# EAGLE schematic airbrake-minimal (EAGLE 8.4.2)
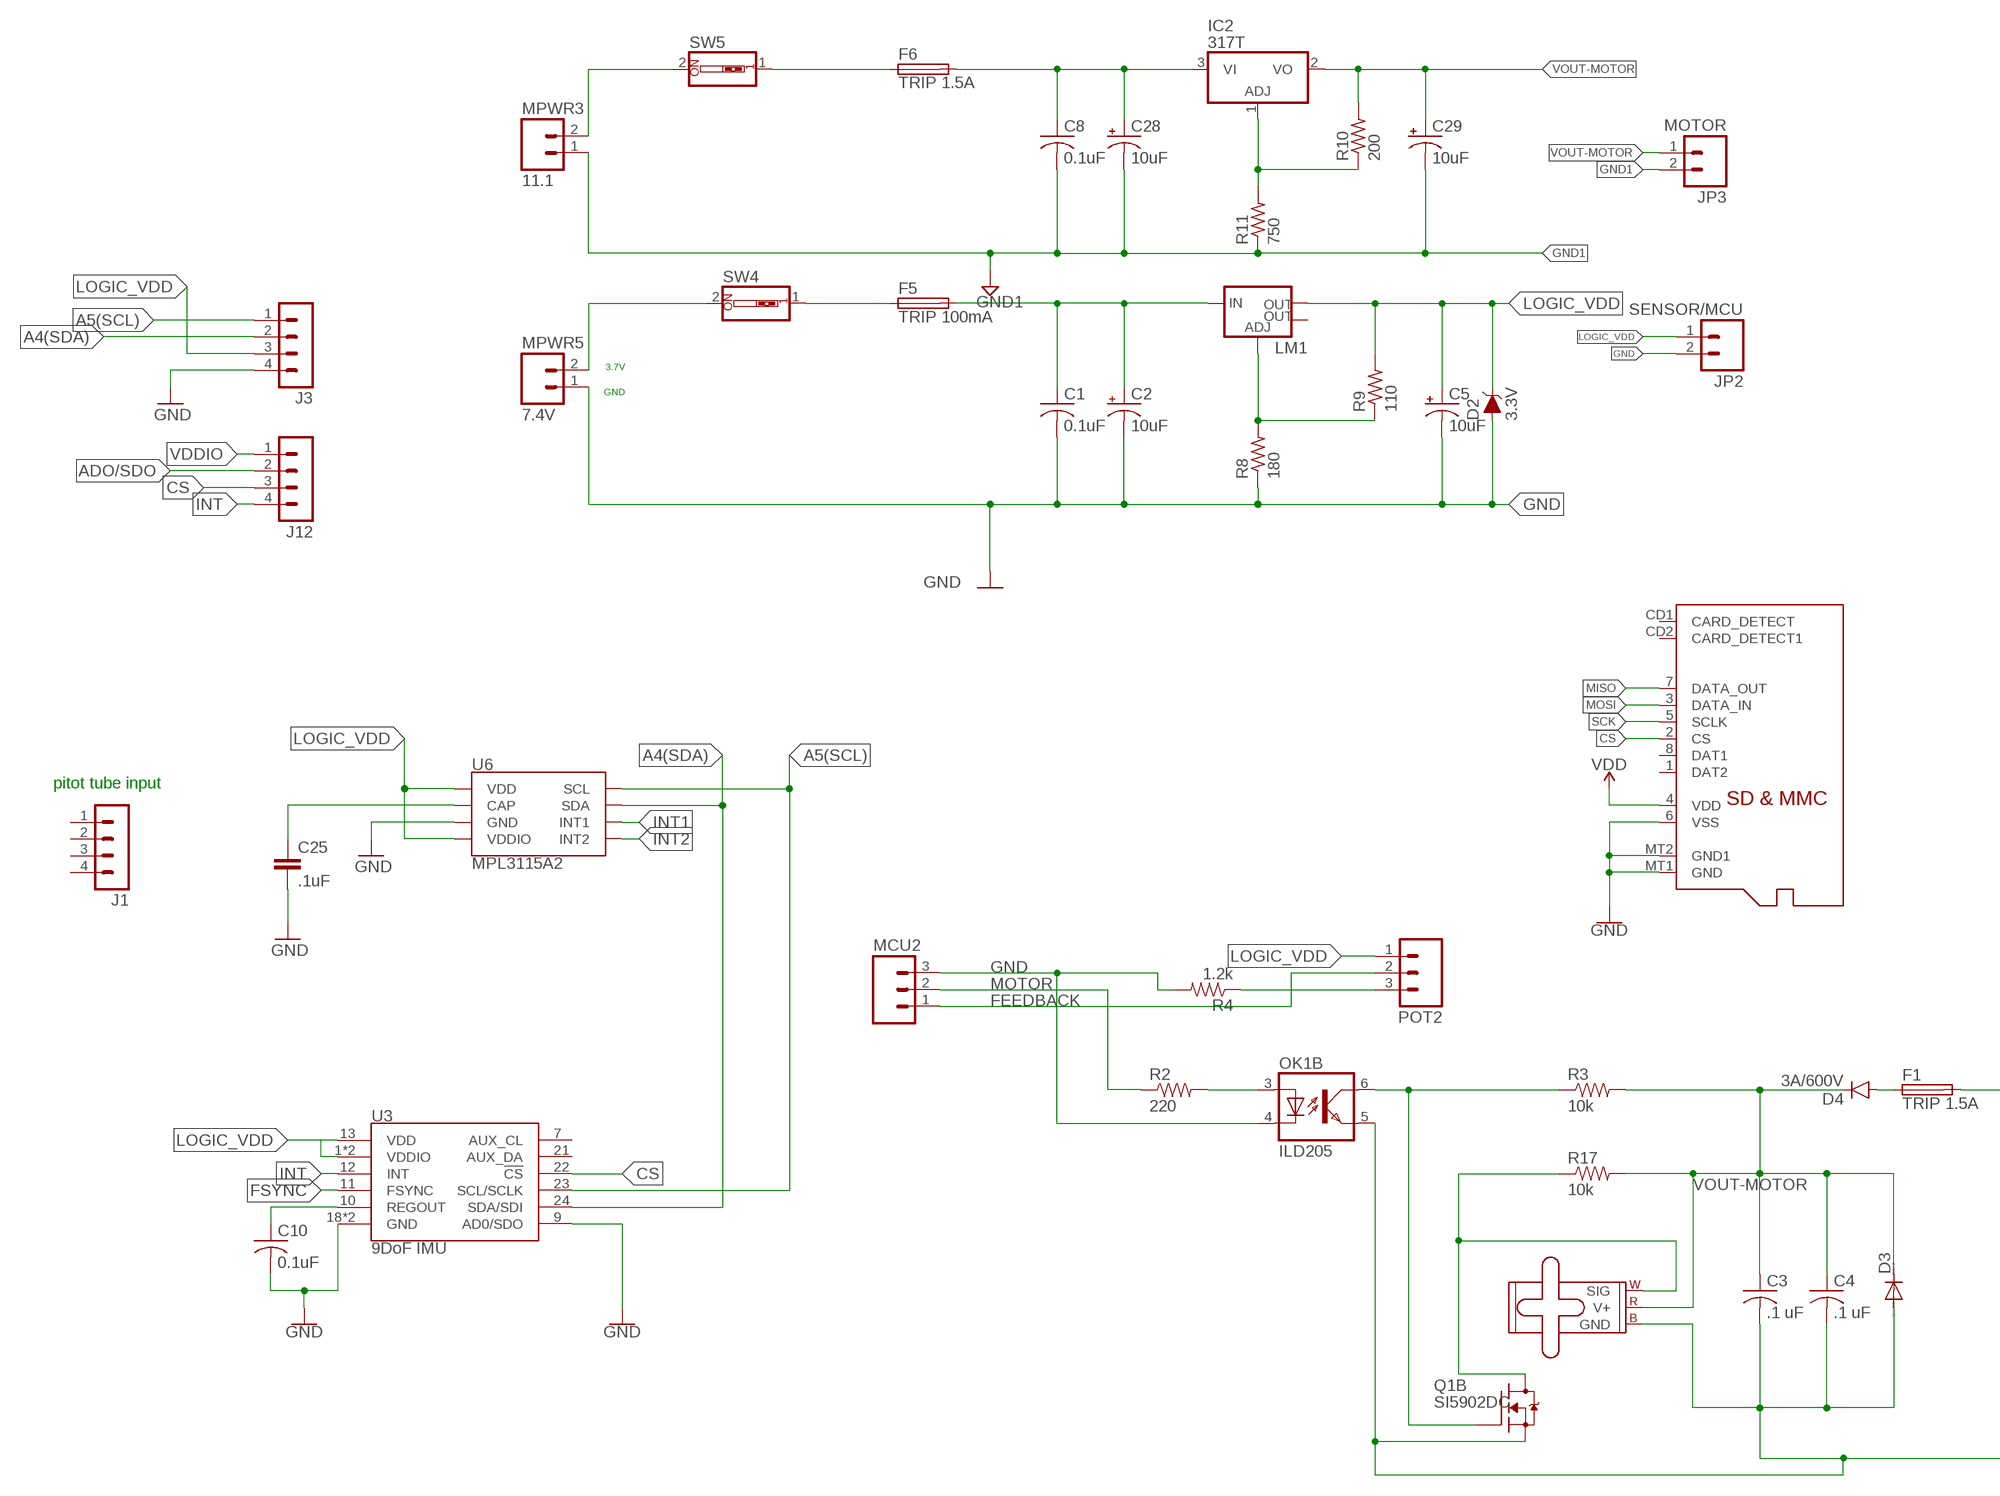
[diagram p0: schematic, sheet 1, part 1 of 2]
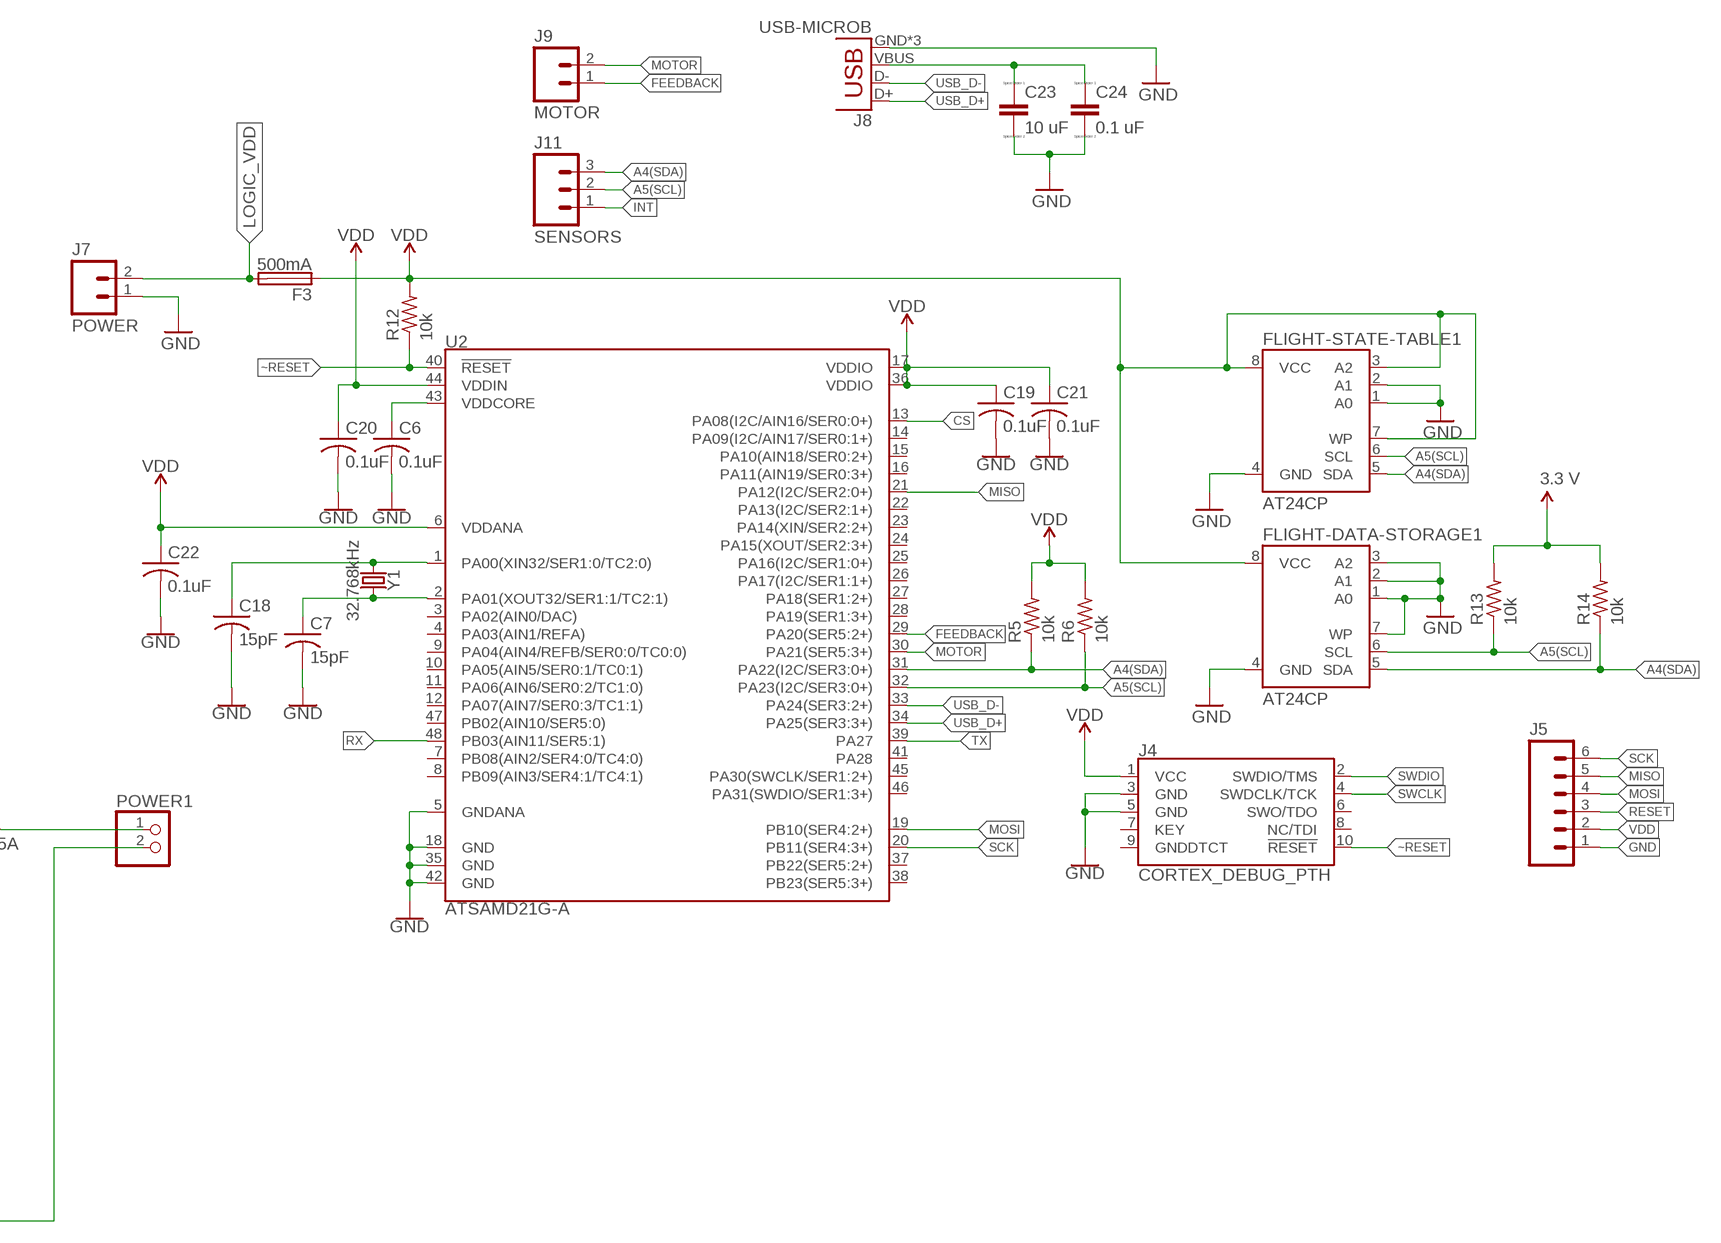
[diagram p1: schematic, sheet 1, part 2 of 2]

## Parts
C1  0.1uF  C-USC1206  [C1206]
C2  10uF  10UF-POLAR-EIA3216-16V-10%(TANT)  [EIA3216]
C3  .1 uF  C-USC1206K  [C1206K]
C4  .1 uF  C-USC1206K  [C1206K]
C5  10uF  10UF-POLAR-EIA3216-16V-10%(TANT)  [EIA3216]
C6  0.1uF  C-USC0805  [C0805]
C7  15pF  C-USC0805  [C0805]
C8  0.1uF  C-USC1206  [C1206]
C10  0.1uF  C-USC0805  [C0805]
C18  15pF  C-USC0805  [C0805]
C19  0.1uF  C-USC0805  [C0805]
C20  0.1uF  C-USC0805  [C0805]
C21  0.1uF  C-USC0805  [C0805]
C22  0.1uF  C-USC0805  [C0805]
C23  10 uF  CC1206  [C1206]
C24  0.1 uF  CC1206  [C1206]
C25  .1uF  10UF-1206-6.3V-20%  [1206]
C28  10uF  10UF-POLAR-EIA3216-16V-10%(TANT)  [EIA3216]
C29  10uF  10UF-POLAR-EIA3216-16V-10%(TANT)  [EIA3216]
D2  3.3V  DIODE-ZENER-BZT52C3V6S  [SOD-323@2]
D3  DIODE-DO-214AC  [DO-214AC]
D4  3A/600V  DIODESMA-ALT  [SMA-DIODE_ALT]
F1  TRIP 1.5A  PICOFUSE  [PICOFUSE]
F3  500mA  PICOFUSE  [PICOFUSE]
F5  TRIP 100mA  PICOFUSE  [PICOFUSE]
F6  TRIP 1.5A  PICOFUSE  [PICOFUSE]
FLIGHT-DATA-STORAGE1  AT24CP  [DIL08]
FLIGHT-STATE-TABLE1  AT24CP  [DIL08]
IC2  317T  [TO220H]
J1  MA04-1  [MA04-1]
J3  MA04-1  [MA04-1]
J4  CORTEX_DEBUG_PTH  [2X5-PTH-1.27MM]
J5  M06LOCK  [1X06_LOCK]
J7  POWER  M02LOCK  [1X02_LOCK]
J8  USB-MICROB  [USB-MICROB]
J9  MOTOR  M02LOCK  [1X02_LOCK]
J11  SENSORS  M03LOCK  [1X03_LOCK]
J12  MA04-1  [MA04-1]
JP2  SENSOR/MCU  M02PTH  [1X02]
JP3  MOTOR  M02PTH  [1X02]
LM1  V_REG_LM1117SOT223  [SOT223]
M2  SMALL_SERVO  [1X03]
MCU2  M03PTH  [1X03]
MPWR3  11.1  M02PTH  [1X02]
MPWR5  7.4V  M02PTH  [1X02]
OK1  ILD205  [SOIC08]
POT2  M03PTH  [1X03]
POWER1  PINHD-1X2  [1X02]
Q1  SI5902DC  [1206-8CHIP-FET]
R2  220  RESISTOR1206  [1206]
R3  10k  RESISTOR1206  [1206]
R4  1.2k  RESISTOR1206  [1206]
R5  10k  R-US_R0805  [R0805]
R6  10k  R-US_R0805  [R0805]
R8  180  R-US_M1206  [M1206]
R9  110  R-US_M1206  [M1206]
R10  200  R-US_M1206  [M1206]
R11  750  R-US_M1206  [M1206]
R12  10k  R-US_R0805  [R0805]
R13  10k  R-US_R1206  [R1206]
R14  10k  R-US_R1206  [R1206]
R17  10k  RESISTOR1206  [1206]
SW4  SW_DIP-1  [EDG-01]
SW5  SW_DIP-1  [EDG-01]
U2  ATSAMD21G-A  [TQFP-48]
U3  9DoF IMU  MPU-9250  [QFN24-3X3]
U6  MPL3115A2  [LGA-8]
U$2  MICROSD  [MICROSD]
Y1  32.768kHz  CRYSTAL-32.768KHZSMD-MC146  [CRYSTAL-SMD-MC-146]

## Nets
A4(SDA): FLIGHT-DATA-STORAGE1.5(SDA) FLIGHT-STATE-TABLE1.5(SDA) J3.2 J11.3 R5.1 R14.1 U2.31(PA22(I2C/SER3:0+)) U3.24(SDA/SDI) U6.7(SDA)
A5(SCL): FLIGHT-DATA-STORAGE1.6(SCL) FLIGHT-STATE-TABLE1.6(SCL) J3.1 J11.2 R6.1 R13.1 U2.32(PA23(I2C/SER3:0+)) U3.23(SCL/SCLK) U6.8(SCL)
ADO/SDO: J12.2
CS: J12.3 U2.13(PA08(I2C/AIN16/SER0:0+)) U3.22(!CS) U$2.2(CS)
DRAIN1 [motor]: M2.1(SIG) Q1.5(B:D) Q1.6(B:D) R17.1
FEEDBACK: J9.1 MCU2.1 POT2.2 U2.29(PA20(SER5:2+))
FSYNC: U3.11(FSYNC)
GND: C1.2 C2.- C5.- C6.2 C7.2 C10.2 C18.2 C19.2 C20.2 C21.2 C22.2 C23.2 C24.2 C25.2 D2.A FLIGHT-DATA-STORAGE1.1(A0) FLIGHT-DATA-STORAGE1.2(A1) FLIGHT-DATA-STORAGE1.3(A2) FLIGHT-DATA-STORAGE1.4(GND) FLIGHT-DATA-STORAGE1.7(WP) FLIGHT-STATE-TABLE1.1(A0) FLIGHT-STATE-TABLE1.2(A1) FLIGHT-STATE-TABLE1.4(GND) J3.4 J4.3(GND) J4.5(GND) J5.1 J7.1 J8.GND J8.MT1(GND) J8.MT2(GND) JP2.2 MCU2.3 MPWR5.1 R4.2 R8.1 U2.5(GNDANA) U2.18(GND) U2.35(GND) U2.42(GND) U3.9(AD0/SDO) U3.18(GND) U3.20(GND) U6.3(GND) U$2.6(VSS) U$2.MT1(GND) U$2.MT2(GND1)
GND1: C8.2 C28.- C29.- JP3.2 MPWR3.1 R11.1
INT: J11.1 J12.4 U3.12(INT)
INT1: U6.6(INT1)
INT2: U6.5(INT2)
LOGIC_VDD: C5.+ D2.C F3.2 J3.3 J7.2 JP2.1 LM1.2(OUT) POT2.1 R9.2 U6.1(VDD) U6.4(VDDIO)
MGND1: C3.2 C4.2 D3.A M2.3(GND) OK1.5(B:EMIT) POWER1.2 Q1.3(B:S)
MISO: J5.5 U2.21(PA12(I2C/SER2:0+)) U$2.7(DATA_OUT)
MOSI: J5.4 U2.19(PB10(SER4:2+)) U$2.3(DATA_IN)
MOTOR: J9.2 MCU2.2 R2.1 U2.30(PA21(SER5:3+))
N$1: LM1.1(ADJ) R8.2 R9.1
N$2: OK1.3(B:A) R2.2
N$3: MPWR5.2 SW4.2
N$4 [motor]: POWER1.1
N$5: D4.A F1.1
N$6: POT2.3 R4.1
N$10: C1.1 C2.+ F5.2 LM1.3(IN)
N$11: F5.1 SW4.1
N$12: MPWR3.2 SW5.2
N$13: F6.1 SW5.1
N$14: C6.1 U2.43(VDDCORE)
N$15: C10.1 U3.10(REGOUT)
N$16: C7.1 U2.2(PA01(XOUT32/SER1:1/TC2:1)) Y1.P$1
N$17: C18.1 U2.1(PA00(XIN32/SER1:0/TC2:0)) Y1.P$2
N$18: U3.1(VDDIO) U3.8(VDDIO) U3.13(VDD)
N$25: C25.1 U6.2(CAP)
N$27: C8.1 C28.+ F6.2 IC2.3(VI)
N$28: IC2.1(ADJ) R10.1 R11.2
RESET: J5.3
RX: U2.48(PB03(AIN11/SER5:1))
SCGND1: OK1.4(B:C)
SCK: J5.6 U2.20(PB11(SER4:3+)) U$2.5(SCLK)
SIG1 [motor]: OK1.6(B:COL) Q1.4(B:G) R3.1
SWCLK: J4.4(SWDCLK/TCK)
SWDIO: J4.2(SWDIO/TMS)
TX: U2.39(PA27)
USB_D+: J8.D+ U2.34(PA25(SER3:3+))
USB_D-: J8.D- U2.33(PA24(SER3:2+))
USBVDD2: C23.1 C24.1 J8.VBUS
VCC2: F3.1
VDD: C19.1 C20.1 C21.1 C22.1 FLIGHT-DATA-STORAGE1.8(VCC) FLIGHT-STATE-TABLE1.3(A2) FLIGHT-STATE-TABLE1.7(WP) FLIGHT-STATE-TABLE1.8(VCC) J4.1(VCC) J5.2 R5.2 R6.2 R12.2 R13.2 R14.2 U2.6(VDDANA) U2.17(VDDIO) U2.36(VDDIO) U2.44(VDDIN) U$2.4(VDD) ; supply symbol labelled 3.3 V
VDDIO: J12.1
VOUT-MOTOR: C3.1 C4.1 C29.+ D3.C D4.C F1.2 IC2.2(VO) JP3.1 M2.2(V+) R3.2 R10.2 R17.2
~RESET: J4.10(!RESET) R12.1 U2.40(!RESET!)
Unconnected: J1.1 J1.2 J1.3 J1.4 J4.6(SWO/TDO) J4.7(KEY) J4.8(NC/TDI) J4.9(GNDDTCT) LM1.4(OUT) OK1.1(A:A) OK1.2(A:C) OK1.7(A:EMIT) OK1.8(A:COL) Q1.1(A:S) Q1.2(A:G) Q1.7(A:D) Q1.8(A:D) U2.3(PA02(AIN0/DAC)) U2.4(PA03(AIN1/REFA)) U2.7(PB08(AIN2/SER4:0/TC4:0)) U2.8(PB09(AIN3/SER4:1/TC4:1)) U2.9(PA04(AIN4/REFB/SER0:0/TC0:0)) U2.10(PA05(AIN5/SER0:1/TC0:1)) U2.11(PA06(AIN6/SER0:2/TC1:0)) U2.12(PA07(AIN7/SER0:3/TC1:1)) U2.14(PA09(I2C/AIN17/SER0:1+)) U2.15(PA10(AIN18/SER0:2+)) U2.16(PA11(AIN19/SER0:3+)) U2.22(PA13(I2C/SER2:1+)) U2.23(PA14(XIN/SER2:2+)) U2.24(PA15(XOUT/SER2:3+)) U2.25(PA16(I2C/SER1:0+)) U2.26(PA17(I2C/SER1:1+)) U2.27(PA18(SER1:2+)) U2.28(PA19(SER1:3+)) U2.37(PB22(SER5:2+)) U2.38(PB23(SER5:3+)) U2.41(PA28) U2.45(PA30(SWCLK/SER1:2+)) U2.46(PA31(SWDIO/SER1:3+)) U2.47(PB02(AIN10/SER5:0)) U3.7(AUX_CL) U3.21(AUX_DA) U$2.1(DAT2) U$2.8(DAT1) U$2.CD1(CARD_DETECT) U$2.CD2(CARD_DETECT1)

## Notes on the sheet
- 3.7V
- GND
- pitot tube input

## Library data of the parts
C1 C3 C4 C8 = rcl:C-US: CAPACITOR, American symbol
C2 C5 C28 C29 = SparkFun-Capacitors:10UF-POLAR: 10.0µF polarized capacitors A capacitor is a passive two-terminal electrical component used to store electrical energy temporarily in an electric field.; PROD_ID: CAP-00811
C6 C7 C10 C18-C22 = adafruit:C-US: CAPACITOR, American symbol
C23 C24 = eagle-ltspice:C: CAPACITOR, European symbol; SPICEMODEL: NONE; SPICEPREFIX: C
C25 = SparkFun-Capacitors:10UF: 10.0µF ceramic capacitors A capacitor is a passive two-terminal electrical component used to store electrical energy temporarily in an electric field.; PROD_ID: CAP-10057; VALUE: 10uF
D2 = SparkFun-DiscreteSemi:DIODE-ZENER: Zener Diode A Zener diode allows current to flow from its anode to its cathode like a normal semiconductor diode, but it also permits current to flow in the reverse direction when its "Zener voltage" is reached. - WIkipedia; PROD_ID: DIO-08199; VALUE: 3.6V
D3 = diode:DIODE-: DIODE
D4 = SparkFun-DiscreteSemi:DIODE: Diode These are standard reverse protection diodes and small signal diodes. SMA package can handle up to about 1A. SOD-323 can handle about 200mA. What the SOD-323 package when ordering, there are some mfgs out there that are 5-pin packages.
F1 F3 F5 F6 = fuse:PICOFUSE: PICOFUSE 19275, Wickmann; OC_FARNELL: unknown; OC_NEWARK: unknown
FLIGHT-DATA-STORAGE1 FLIGHT-STATE-TABLE1 = atmel:AT24C*: 2-wire serial EEPROM; MPN: AT24C1024BW-SH-B; OC_FARNELL: 1362646; OC_NEWARK: 03P2044
IC2 = linear:*317: Positive VOLTAGE REGULATOR
J1 J3 J12 = con-lstb:MA04-1: PIN HEADER; OC_FARNELL: unknown; OC_NEWARK: unknown
J4 = SparkFun-Connectors:CORTEX_DEBUG: Cortex Debug Connector - 10 pin Supports JTAG debug, Serial Wire debug, and Serial Wire Viewer. PTH and SMD connector options available. General Connector Information <http://infocenter.arm.com/help/topic/com.arm.doc.faqs/attached/13634/cortex_debug_connectors.pdf> Products: PTH Connector <http://www.digikey.com/product-detail/en/cnc-tech/3220-10-0100-00/1175-1627-ND/3883661> -via Digi-Key SparkFun PSoc <https://www.sparkfun.com/products/13229> SparkFun T <https://www.sparkfun.com/products/13810>
J5 = SparkFun-Connectors:M06: Header 6 Standard 6-pin 0.1" header. Use with straight break away headers (SKU : PRT-00116), right angle break away headers (PRT-00553), swiss pins (PRT-00743), machine pins (PRT-00117), and female headers (PRT-00115). Molex polarized connector foot print use with SKU : PRT-08094 with associated crimp pins and housings. NOTES ON THE VARIANTS LOCK and LOCK_LONGPADS... This footprint was designed to help hold the alignment of a through-hole component (i.e. 6-pin header) while soldering it into place. You may notice that each hole has been shifted either up or down by 0.005 of an inch from it's more standard position (which is a perfectly straight line). This slight alteration caused the pins (the squares in the middle) to touch the edges of the holes. Because they are alternating, it causes a "brace" to hold the component in place. 0.005 has proven to be the perfect amount of "off-center" position when using our standard breakaway headers. Although looks a little odd when you look at the bare footprint, once you have a header in there, the alteration is very hard to notice. Also,if you push a header all the way into place, it is covered up entirely on the bottom side. This idea of altering the position of holes to aid alignment will be further integrated into the Sparkfun Library for other footprints. It can help hold any component with 3 or more connection pins.
J7 J9 JP2 JP3 MPWR3 MPWR5 = SparkFun-Connectors:M02: Standard 2-pin 0.1" header. Use with - straight break away headers ( PRT-00116) - right angle break away headers (PRT-00553) - swiss pins (PRT-00743) - machine pins (PRT-00117) - female headers (PRT-00115) Molex polarized connector foot print use with: PRT-08233 with associated crimp pins and housings. 2.54_SCREWTERM for use with PRT-10571. 3.5mm Screw Terminal footprints for PRT-08084 5mm Screw Terminal footprints for use with PRT-08432
J8 = SparkFun-Connectors:USB: USB Connectors USB-B-PTH is fully proven SKU : PRT-00139/CONN-08278 USB-miniB is fully proven SKU : PRT-00587 USB-A-PCB is untested. USB-A-H is throughly reviewed, but untested. Spark Fun Electronics SKU : PRT-00437 USB-B-SMT is throughly reviewed, but untested. Needs silkscreen touching up. USB-A-S has not been used/tested USB-MB-H has not been used/tested USB-MICROB has been used. CONN-09505; PROD_ID: CONN-09505
J11 MCU2 POT2 = SparkFun-Connectors:M03: Header 3 Standard 3-pin 0.1" header. Use with straight break away headers (SKU : PRT-00116), right angle break away headers (PRT-00553), swiss pins (PRT-00743), machine pins (PRT-00117), and female headers (PRT-00115). Molex polarized connector foot print use with SKU : PRT-08232 with associated crimp pins and housings.
LM1 = SparkFun-IC-Power:V_REG_LM1117: Voltage Regulator LM1117 Standard adjustable voltage regulator but in SMD form. Spark Fun Electronics SKU : COM-00595; PROD_ID: VREG-08170
M2 = SparkFun-Electromechanical:SMALL_SERVO: Small servo motor This is the small servo used in the SIK. SKU: ROB-09065
OK1 = optocoupler:ILD2*: Siemens ILD205/206/207/211/213/217 DUAL PHOTOTRANSISTOR SMALL OUTLINE SURFACE MOUNT OPTOCOUPLER Source: 153385-da-01-en-Optocoupler_ILD205-T.pdf; MF: VISHAY/TELEFUNKEN; MPN: ILD205T; OC_FARNELL: 1469512; OC_NEWARK: 20H8678
POWER1 = pinhead:PINHD-1X2: PIN HEADER
Q1 = transistor-fet:SI5902DC: Dual N-Channel 30-V (D-S) MOSFET Source: http://www.vishay.com/docs/71053/71053.pdf
R2-R4 R17 = SparkFun-Passives:RESISTOR: Resistor Basic schematic elements and footprints for 0603, 1206, and PTH resistors.
R5 R6 R12-R14 = adafruit:R-US_: RESISTOR, American symbol
R8-R11 = rcl:R-US_: RESISTOR, American symbol
SW4 SW5 = special:SW_DIP-1: DIP SWITCH
U2 = SparkFun-IC-Microcontroller:ATSAMD21G: Atmel SAMD21G SMART ARM-Based Microcontroller The Atmel ® | SMART ™ SAM D21 is a series of low-power microcontrollers using the 32-bit ARM ® Cortex ® -M0+ processor, and ranging from 32- to 64-pins with up to 256KB Flash and 32KB of SRAM. The SAM D21 devices operate at a maximum frequency of 48MHz and reach 2.46 CoreMark/MHz. They are designed for simple and intuitive migration with identical peripheral modules, hex compatible code, identical linear address map and pin compatible migration paths between all devices in the product series. All devices include intelligent and flexible peripherals, Atmel Event System for inter-peripheral signaling, and support for capacitive touch button, slider and wheel user interfaces. Datasheet <https://cdn.sparkfun.com/datasheets/Dev/Arduino/Boards/Atmel-42181-SAM-D21_Datasheet.pdf> SparkFun Products SparkFun SAMD21 Mini Breakout <https://www.sparkfun.com/products/13664> (DEV-13664) SparkFun SAMD21 Dev Breakout <https://www.sparkfun.com/products/13672> (DEV-13672); PROD_ID: IC-13064
U3 = SparkFun-Sensors:MPU-9250: MPU-9250 9 Degree of Freedom IMU System in Package that contains MPU-6500 & AK8963 NC pin 19. 2-6 & 14-17 not internally connected. May be used for PCB trace routing. Datasheet <https://cdn.sparkfun.com/assets/learn_tutorials/5/5/0/MPU9250REV1.0.pdf> SparkFun Products: SparkFun 9DoF Razor IMU M0 <https://www.sparkfun.com/products/14001> SparkFun IMU Breakout - MPU-9250 <https://www.sparkfun.com/products/13762>; PROD_ID: IC-13192
U6 = SparkFun-Sensors:MPL3115A2: NXP MPL3115A2 Digital Altimeter/Pressure Sensor The MPL3115A2 is a compact piezoresistive absolute pressure sensor with an I2C interface. MPL3115 has a wide operating range of 20kPa to 110 kPa, a range that covers all surface elevations on Earth. The fully internally compensated MEMS in conjunction with an embedded high resolution 24-bit equivalent ADC provide accurate pressure [Pascals] /altitude [meters] and temperature [degrees Celsius] data. Datasheet <http://cdn.sparkfun.com/datasheets/Sensors/Pressure/MPL3115A2.pdf> SparkFun Products SparkFun Altitude/Pressure Sensor Breakout - MPL3115A2 <https://www.sparkfun.com/products/11084> (SEN-11084) SparkFun Weather Shield <https://www.sparkfun.com/products/12081> (DEV-12081) SparkFun Photon Weather Shield <https://www.sparkfun.com/products/13630> (DEV-13630); PROD_ID: IC-10869
U$2 = adafruit:MICROSD: Micro-SD / Transflash card holder with SPI pinout For the 3M # 2908-05WB-MG and/or 4UCON #19656 push-push type
Y1 = SparkFun-Clocks:CRYSTAL-32.768KHZ: 32.768kHz Crystal Frequency: 32.768kHz Frequency Stability: ±20ppm Load Capacitance: 12.5pF (PTH-2X6 & SMD-3.2X1.5), 6pF (SMD-2X6) SparkFun Products: SparkFun BigTime Watch Kit <https://www.sparkfun.com/products/11734> SparkFun nRF52832 Breakout <https://www.sparkfun.com/products/13990> SparkFun Real Time Clock Module <https://www.sparkfun.com/products/12708>; PROD_ID: XTAL-09342

## Net classes
1 motor: width 0.61 mm